# Altium schematic sheet SPI_Diff_Slave.SchDoc
size A4; Organization: HTL Hollabrunn; Address1: Abteilung Elektronik; Address2: Anton Ehrenfried-Straße 10; Address3: 2020 Hollabrunn
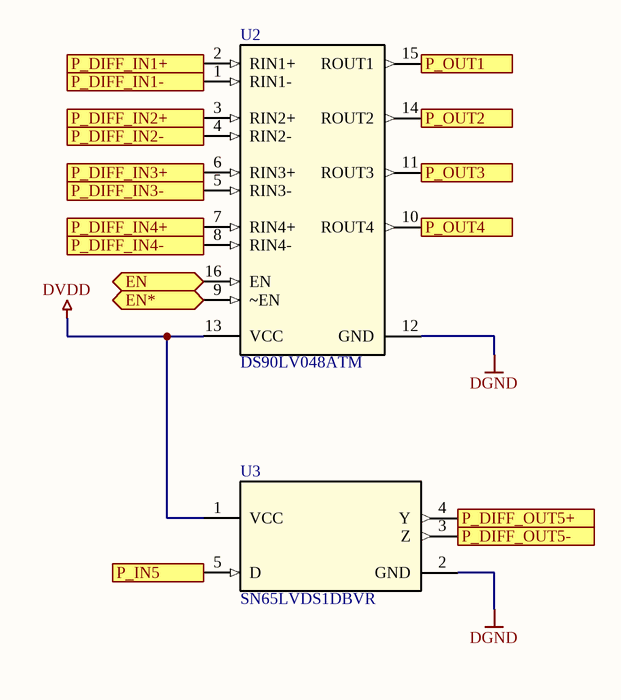
[diagram p0: SPI_Diff_Slave.SchDoc]

## Parts
U2  DS90LV048ATM  [SOIC-16N]
U3  SN65LVDS1DBVR  [DBV5]

## Ports
EN (bidir), EN* (bidir), P_DIFF_IN1+ (in), P_DIFF_IN1- (in), P_DIFF_IN2+ (in), P_DIFF_IN2- (in), P_DIFF_IN3+ (in), P_DIFF_IN3- (in), P_DIFF_IN4+ (in), P_DIFF_IN4- (in), P_DIFF_OUT5+ (out), P_DIFF_OUT5- (out), P_IN5 (in), P_OUT1 (out), P_OUT2 (out), P_OUT3 (out), P_OUT4 (out)

## Nets
DGND: U2.12(GND) U3.2(GND)
DVDD: U2.13(VCC) U3.1(VCC)
EN: U2.16(EN) ; port EN
EN*: U2.9(~EN) ; port EN*
P_DIFF_IN1+: U2.2(RIN1+) ; port P_DIFF_IN1+
P_DIFF_IN1-: U2.1(RIN1-) ; port P_DIFF_IN1-
P_DIFF_IN2+: U2.3(RIN2+) ; port P_DIFF_IN2+
P_DIFF_IN2-: U2.4(RIN2-) ; port P_DIFF_IN2-
P_DIFF_IN3+: U2.6(RIN3+) ; port P_DIFF_IN3+
P_DIFF_IN3-: U2.5(RIN3-) ; port P_DIFF_IN3-
P_DIFF_IN4+: U2.7(RIN4+) ; port P_DIFF_IN4+
P_DIFF_IN4-: U2.8(RIN4-) ; port P_DIFF_IN4-
P_DIFF_OUT5+: U3.4(Y) ; port P_DIFF_OUT5+
P_DIFF_OUT5-: U3.3(Z) ; port P_DIFF_OUT5-
P_IN5: U3.5(D) ; port P_IN5
P_OUT1: U2.15(ROUT1) ; port P_OUT1
P_OUT2: U2.14(ROUT2) ; port P_OUT2
P_OUT3: U2.11(ROUT3) ; port P_OUT3
P_OUT4: U2.10(ROUT4) ; port P_OUT4

## Notes on the sheet
- Title
- Size:
- Date:
- A4
- Number:
- Time:
- Revision:
- Sheet
- of
- HTL Hollabrunn
- Abteilung Elektronik
- Anton Ehrenfried-Straße 10
- 2020 Hollabrunn
- File:
- Drawn By:

## Library data of the parts
U2 = DS90LV048ATM: 400-Mbps LVDS quad high-speed differential receiver 16-SOIC -40 to 85; Manufacturer_Name: Texas Instruments; Manufacturer: NationalSemiconductor; PackageTopMarking: NS2ZXYTTE#DS90LV048ATM; PowerWise: N; CompType: InterfaceIC; ComponentLink1DescBC: DS90LV048ADatasheet; ComponentLink2DescA4: DS90LV048AWebPage; ComponentLink3DescAC: M16APackagePage; Copyright: Copyright (C) 2026 Ultra Librarian. All rights reserved.; Manufacturer_Part_Number: DS90LV048ATM; Datasheet: https://www.ti.com/lit/gpn/ds90lv048a; Published: 4-Dec-2008; DatasheetVersion: May-2001; PackageVersion: revJAug-1995; PackageReference: M16A; Publisher: AltiumLimited; PackageDescription: MoldedPackageSO150inWide16Lead; Supplier: 1Farnell; SUPPLIER_2: PartNumb0C9485856; PartNumber: DS90LV048ATM; RoHS: N; PinCount: 16; Code_JEDEC: MS-012-AC; Code_IPC: SOIC127P600-16; ComponentLink1URL: http//wwwnationalcom/ds/DS/DS90LV048Apdf; ComponentLink2URL: http//wwwnationalcom/pf/DS/DS90LV048Ahtml; ComponentLink3URL: http//wwwnationalcom/packaging/folders/m16ahtml
U3 = SN65LVDS1DBVR: 630-Mbps single LVDS driver 5-SOT-23 -40 to 85; Manufacturer_Name: Texas Instruments; Alternate_PartNumber: SN65LVDS1DBVT; CompType: IC; TYPE: TYPE; RefDes: RefDes; Copyright: Copyright (C) 2026 Ultra Librarian. All rights reserved.; Manufacturer_Part_Number: SN65LVDS1DBVR; PartNumber: SN65LVDS1DBVR; PackageReference: DBV0005A; MountType: SMT; RoHS: Y; Manufacturer: Texas Instruments